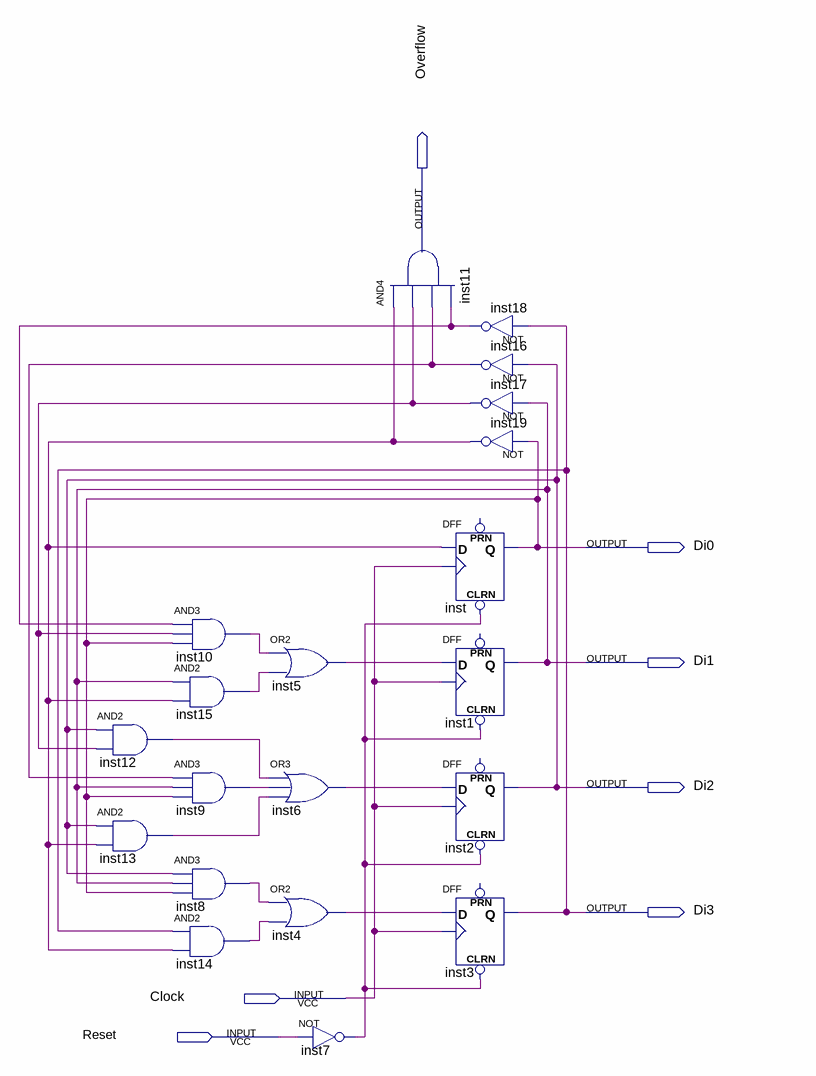
[diagram p0: schematic sheet]
// Quartus schematic BCDCounter.bdf as structural Verilog: 20 symbols, 7 pins
module BCDCounter (
  input  Clock,
  input  Reset,
  output Overflow,
  output Di0,
  output Di1,
  output Di2,
  output Di3
);

  wire inst4_out, inst5_out, inst6_out, inst7_out, inst8_out, inst9_out, inst10_out, inst12_out, inst13_out,
       inst14_out, inst15_out, inst16_out, inst17_out, inst18_out, inst19_out;

  and inst12 (inst12_out, Di2, inst17_out);
  and inst13 (inst13_out, Di2, inst19_out);
  and inst10 (inst10_out, inst18_out, inst17_out, Di0);
  and inst15 (inst15_out, Di1, inst19_out);
  and inst9 (inst9_out, inst16_out, Di1, Di0);
  and inst8 (inst8_out, Di2, Di1, Di0);
  and inst14 (inst14_out, Di3, inst19_out);
  or inst5 (inst5_out, inst10_out, inst15_out);
  or inst6 (inst6_out, inst12_out, inst9_out, inst13_out);
  or inst4 (inst4_out, inst8_out, inst14_out);
  not inst7 (inst7_out, Reset);
  and inst11 (Overflow, inst19_out, inst17_out, inst16_out, inst18_out);
  not inst18 (inst18_out, Di3);
  not inst16 (inst16_out, Di2);
  not inst17 (inst17_out, Di1);
  not inst19 (inst19_out, Di0);
  DFF inst (.CLRN(inst7_out), .CLK(Clock), .D(inst19_out), .Q(Di0));  // open: PRN
  DFF inst1 (.CLRN(inst7_out), .CLK(Clock), .D(inst5_out), .Q(Di1));  // open: PRN
  DFF inst2 (.CLRN(inst7_out), .CLK(Clock), .D(inst6_out), .Q(Di2));  // open: PRN
  DFF inst3 (.CLRN(inst7_out), .CLK(Clock), .D(inst4_out), .Q(Di3));  // open: PRN
endmodule
